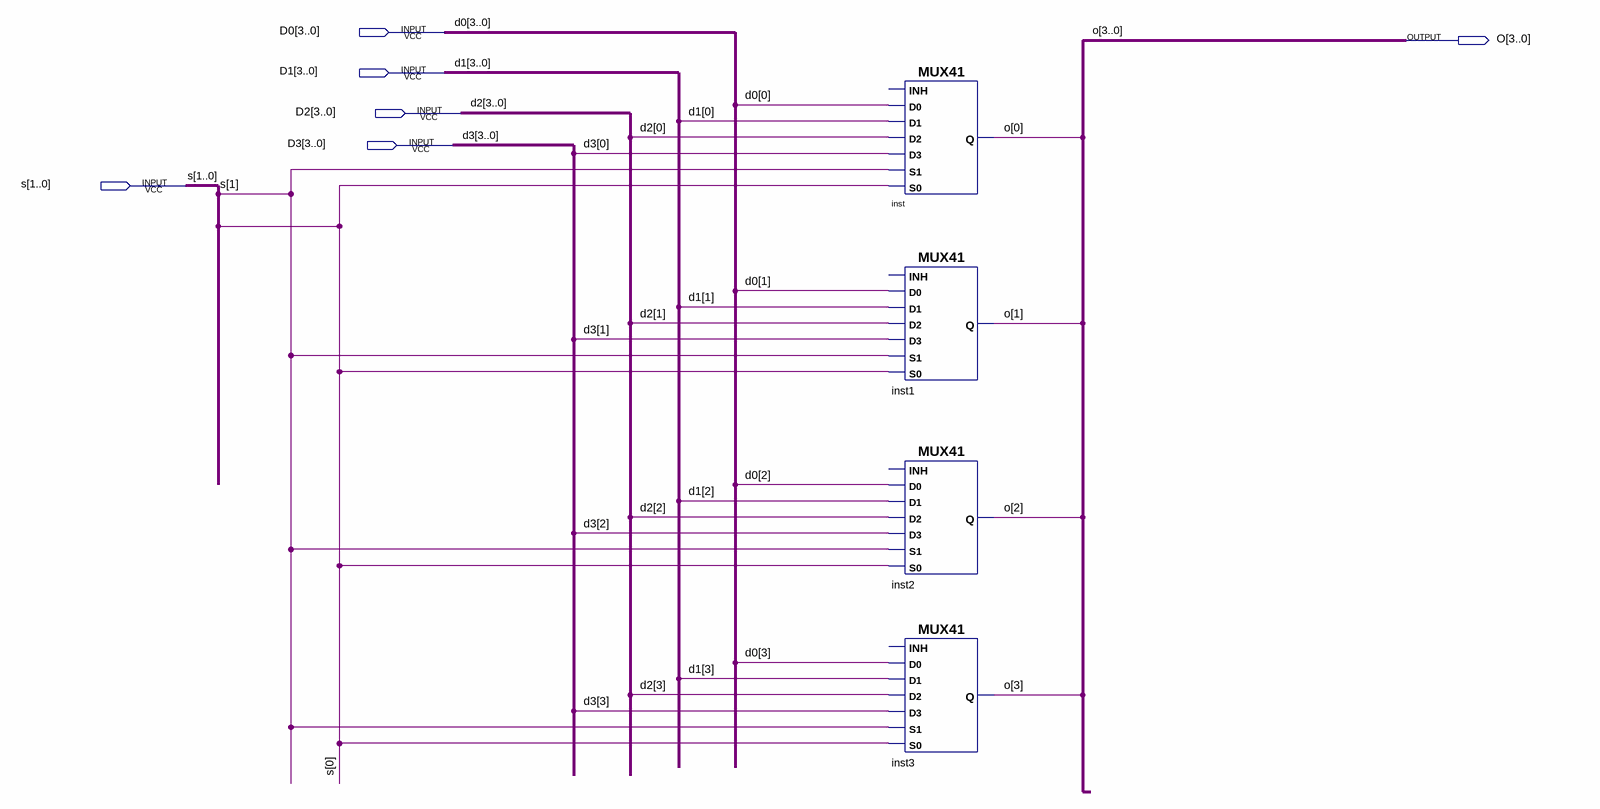
[diagram p0: schematic sheet]
// Quartus schematic 4bit_mux.bdf as structural Verilog: 4 symbols, 6 pins
module \4bit_mux  (
  input  [3:0] D0,
  input  [3:0] D1,
  input  [3:0] D2,
  input  [3:0] D3,
  input  [1:0] s,
  output [3:0] O
);

  MUX41 inst (.S0(s[0]), .D2(D2[0]), .S1(s[1]), .D3(D3[0]), .D0(D0[0]), .D1(D1[0]), .Q(O[0]));  // open: INH
  MUX41 inst1 (.S0(s[0]), .D2(D2[1]), .S1(s[1]), .D3(D3[1]), .D0(D0[1]), .D1(D1[1]), .Q(O[1]));  // open: INH
  MUX41 inst2 (.S0(s[0]), .D2(D2[2]), .S1(s[1]), .D3(D3[2]), .D0(D0[2]), .D1(D1[2]), .Q(O[2]));  // open: INH
  MUX41 inst3 (.S0(s[0]), .D2(D2[3]), .S1(s[1]), .D3(D3[3]), .D0(D0[3]), .D1(D1[3]), .Q(O[3]));  // open: INH
endmodule
